# Altium schematic sheet Bluetooth_Module.SchDoc
size A3; SheetNumber: 4; SheetTotal: 7
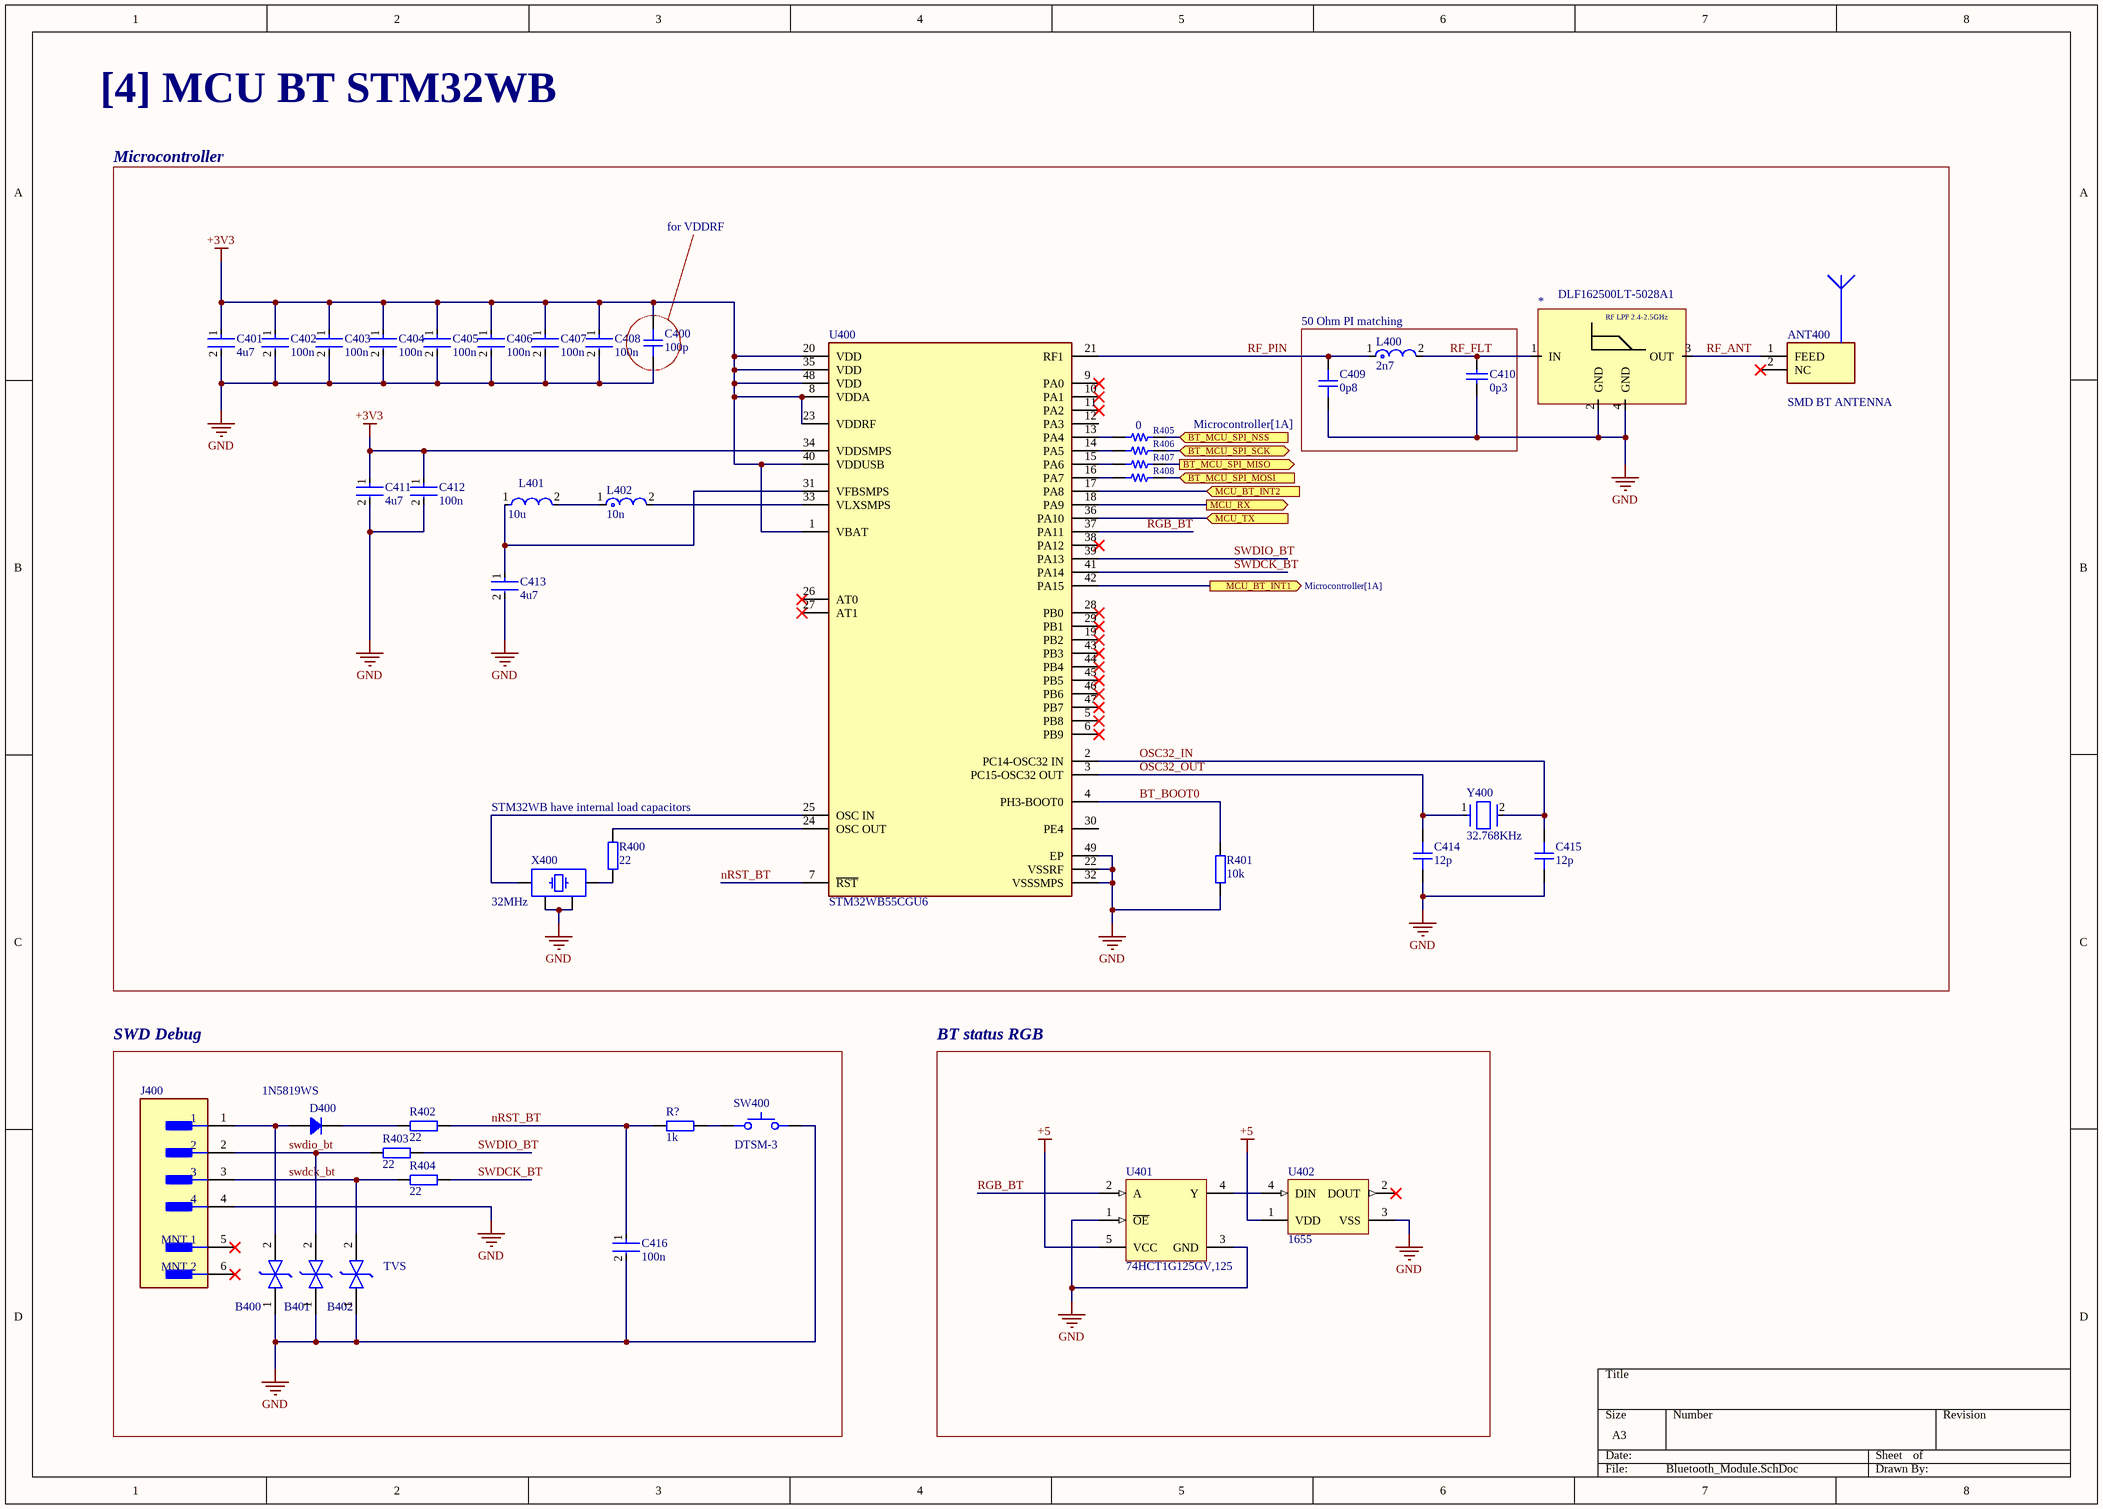
[diagram p0: Bluetooth_Module.SchDoc]

## Parts
*  DLF162500LT-5028A1  [DLF162500LT-5028A1]
ANT400  SMD BT ANTENNA  [ANTC3216X130N]
B400  TVS  [SODFL1608X65N]  (value not drawn)
B401  TVS  [SODFL1608X65N]  (value not drawn)
B402  TVS  [SODFL1608X65N]
C400  100p  [CAP_0402]
C401  4u7  [FP-CL10-IPC_C]
C402  100n  [FP-CL779-IPC_C]
C403  100n  [FP-CL779-IPC_C]
C404  100n  [FP-CL779-IPC_C]
C405  100n  [FP-CL779-IPC_C]
C406  100n  [FP-CL779-IPC_C]
C407  100n  [FP-CL779-IPC_C]
C408  100n  [FP-CL779-IPC_C]
C409  0p8  [CAP_0402]
C410  0p3  [CAPC1005X55X25NL05T10]
C411  4u7  [FP-CL10-IPC_C]
C412  100n  [FP-CL779-IPC_C]
C413  4u7  [FP-CL10-IPC_C]
C414  12p  [CAP_0402]
C415  12p  [CAP_0402]
C416  100n  [FP-CL779-IPC_C]
D400  1N5819WS  [SOD323F]
J400  S4B-XH-SM4-TB(LF)(SN)  [FP-S4B-XH-SM4-TB_LF_SN-MFG]  (value not drawn)
L400  2n7  [FP-LQG15HH_02-IPC_C]
L401  10u  [FP-LQM21FN_70-MFG]
L402  10n  [FP-LQG15WH_02-MFG]
R400  22  [RES_0402]
R401  10k  [RES_0402]
R402  22  [RES_0402]
R403  22  [RES_0402]
R404  22  [RES_0402]
R405  0  [RES 0402_1005]
R406  0  [RES 0402_1005]  (value not drawn)
R407  0  [RES 0402_1005]  (value not drawn)
R408  0  [RES 0402_1005]  (value not drawn)
R?  1k  [RES_0402]
SW400  DTSM-3  [DTSM-3]
U400  STM32WB55CGU6  [FP-STM32WB55CGU6-MFG]
U401  74HCT1G125GV,125  [NXP-SOT753_V]
U402  1655  [ADA-RGB-1655_V]
X400  32MHz  [XTAL_3225]
Y400  32.768KHz  [FP-ABS07AIG-MFG]

## Blocks framed on the sheet
Microcontroller: * ANT400 C400-C408 C411-C415 L401 L402 R400 R401 R405-R408 U400 X400 Y400
50 Ohm PI matching: C409 C410 L400
SWD Debug: B400-B402 C416 D400 J400 R402-R404 R? SW400
BT status RGB: U401 U402

## Ports
BT_MCU_SPI_MISO (out, see Microcontroller[1A]), BT_MCU_SPI_MOSI (in, see Microcontroller[1A]), BT_MCU_SPI_NSS (in, see Microcontroller[1A]), BT_MCU_SPI_SCK (bidir, see Microcontroller[1A]), MCU_BT_INT1 (out, see Microcontroller[1A]), MCU_BT_INT2 (in, see Microcontroller[1A]), MCU_RX (out, see Microcontroller[1A]), MCU_TX (in, see Microcontroller[1A])

## Nets
+3V3: C400.2 C401.1 C402.1 C403.1 C404.1 C405.1 C406.1 C407.1 C408.1 C411.1 C412.1 U400.1(VBAT) U400.8(VDDA) U400.20(VDD) U400.23(VDDRF) U400.34(VDDSMPS) U400.35(VDD) U400.40(VDDUSB) U400.48(VDD)
+5: U401.5(VCC) U402.1(VDD)
GND: *.2(GND) *.4(GND) B400.1(K1) B401.1(K1) B402.1(K1) C400.1 C401.2 C402.2 C403.2 C404.2 C405.2 C406.2 C407.2 C408.2 C409.1 C410.1 C411.2 C412.2 C413.2 C414.1 C415.1 C416.2 J400.4 R401.2 SW400.2 U400.22(VSSRF) U400.32(VSSSMPS) U400.49(EP) U401.1(~{OE}) U401.3(GND) U402.3(VSS) X400.2 X400.4
BT_BOOT0: R401.1 U400.4(PH3-BOOT0)
BT_MCU_SPI_MISO: R407.2 ; port BT_MCU_SPI_MISO
BT_MCU_SPI_MOSI: R408.2 ; port BT_MCU_SPI_MOSI
BT_MCU_SPI_NSS: R405.2 ; port BT_MCU_SPI_NSS
BT_MCU_SPI_SCK: R406.2 ; port BT_MCU_SPI_SCK
MCU_BT_INT1: U400.42(PA15) ; port MCU_BT_INT1
MCU_BT_INT2: U400.17(PA8) ; port MCU_BT_INT2
MCU_RX: U400.18(PA9) ; port MCU_RX
MCU_TX: U400.36(PA10) ; port MCU_TX
nRST_BT: C416.1 R402.1 R?.2 U400.7(~{RST})
OSC32_IN: C415.2 U400.2(PC14-OSC32_IN) Y400.2
OSC32_OUT: C414.2 U400.3(PC15-OSC32_OUT) Y400.1
RF_ANT: *.3(OUT) ANT400.1(FEED)
RF_FLT: *.1(IN) C410.2 L400.2
RF_PIN: C409.2 L400.1 U400.21(RF1)
RGB_BT: U400.37(PA11) U401.2(A)
SWDCK_BT: B402.2(K2) J400.3 R404.1 R404.2 U400.41(PA14)
SWDIO_BT: B401.2(K2) J400.2 R403.1 R403.2 U400.39(PA13)
NetB400_2: B400.2(K2) D400.1 J400.1
NetC413_1: C413.1 L401.1 U400.31(VFBSMPS)
NetD400_2: D400.2 R402.2
NetL401_2: L401.2 L402.1
NetL402_2: L402.2 U400.33(VLXSMPS)
NetR400_1: R400.1 U400.24(OSC_OUT)
NetR400_2: R400.2 X400.3
NetR405_1: R405.1 U400.13(PA4)
NetR406_1: R406.1 U400.14(PA5)
NetR407_1: R407.1 U400.15(PA6)
NetR408_1: R408.1 U400.16(PA7)
NetR?_1: R?.1 SW400.1
NetU400_25: U400.25(OSC_IN) X400.1
NetU401_4: U401.4(Y) U402.4(DIN)

Not connected (* = marked no-connect by the designer): ANT400 2(NC)*; J400 5(MNT_1)* 6(MNT_2)*; U400 5(PB8)* 6(PB9)* 9(PA0)* 10(PA1)* 11(PA2)* 12(PA3) 19(PB2)* 26(AT0)* 27(AT1)* 28(PB0)* 29(PB1)* 30(PE4) 38(PA12)* 43(PB3)* 44(PB4)* 45(PB5)* 46(PB6)* 47(PB7)*; U402 2(DOUT)*

## Notes on the sheet
- [4] MCU BT STM32WB
- for VDDRF
- (near R400) STM32WB have internal load capacitors
- (in symbol DLF162500LT-5028A1) RF LPF 2.4-2.5GHz

## Library data of the parts
ANT400 = RFANT3216120A1T: Antennas 2450+/-50MHz 2.5GHz Fc 2dBi RFANT3216120A1T; Manufacturer_Name: Walsin Technology Corporation; Geometry.Height: 1.3mm; TME Electronic Components Part Number: *; TME Electronic Components Price/Stock: *; Manufacturer_Part_Number: RFANT3216120A1T; Datasheet Link: *
B400-B402 = PESD5V0S1BB_115: PESD5V0S1BB - Bidirectional ESD protection diode Vbr = 5.5V, Vc; Manufacturer_Name: Nexperia; Manufacturer_Part_Number: PESD5V0S1BB,115; Geometry.Height: 0.65mm; Mouser Part Number: 771-PESD5V0S1BB-T/R; Mouser Price/Stock: https://www.mouser.co.uk/ProductDetail/Nexperia/PESD5V0S1BB115?qs=LOCUfHb8d9vW06zz0pOppQ%3D%3D; Arrow Part Number: PESD5V0S1BB,115; Arrow Price/Stock: https://www.arrow.com/en/products/pesd5v0s1bb115/nexperia; Datasheet Link: https://assets.nexperia.com/documents/data-sheet/PESD5V0S1BB.pdf
C400 C409 C414 C415 = CAP_0402: Capacitor SMD 0402; Manufacturer: *; Manufacturer Part Number: *; Distributor Link: *; LCSC: *; Rating: *; Dielectric: *
C401 C411 C413 = CMP-13271-004224-1: Cap Ceramic 10uF 25V X5R ±20% Pad SMD 0603 +85°C T/R; Width: 0.031inch; Voltage Rating: 25V; Length: 0.063inch; Case Code (Metric): 1608; Dielectric: X5R; Termination: Wraparound; Capacitance: 10uF; Lead Free: Lead Free; Mount: Surface Mount; Package Quantity: 1; Case Code (Imperial): 0603; Thickness: 0.035inch; Packaging: Tape and Reel; Contact Plating: Tin; Min Operating Temperature: -55°C; Tolerance: 20%; Max Operating Temperature: 85°C; Case/Package: 0603
C402-C408 C412 C416 = CMP-13271-002336-1: Cap Ceramic 100nF 50V X7R ±10% SMD 0402 +125°C Paper T/R CL05B104KB54PNC
C410 = CMP-1034-00007-2: GRM1555C1HR30WA01D; Manufacturer: Murata; Part Number: GRM1555C1HR30WA01D
D400 = 1N4148WS: 40V 600mV@1A 1A SOD-323 1N5819WS; Manufacturer: ON Semiconductor; Current - Average Rectified (Io): 150mA; Current - Reverse Leakage @ Vr: 5µA @ 75V; Diode Type: Standard; Reverse Recovery Time (trr): 4ns; Speed: Small Signal =< 200mA (Io), Any Speed; Voltage - DC Reverse (Vr) (Max): 75V; Voltage - Forward (Vf) (Max) @ If: 1V @ 10mA; Part Number: 1N4148WS; ComponentLink1Description: Datasheet; ComponentLink1URL: https://www.onsemi.com/pub/Collateral/1N914BWS-D.pdf; ComponentLink2Description: DigiKey Link; ComponentLink2URL: http://digikey.com/product-detail/en/on-semiconductor/1N4148WS/1N4148WSFSCT-ND/1873821; LastUpdated: 29.01.2024 21:26:23; Lifecycle Status: Active; Minimum Order: 1; Mounting Type: Surface Mount; Operating Temperature - Junction: 150°C (Max); Package / Case: SC-90, SOD-323F; Packaging: TapeAndReel; PartId: 1158; Part Status: Active; Price: 0.03; Series: -; Supplier 1: DigiKey; Supplier Part Number 1: 1N4148WSFSCT-ND; Supplier Device Package: SOD-323F
J400 = CMP-17439-000072-1: CONN HEADER SMD R/A 4POS 2.5MM; Number of Positions: 4; Max Current Rating: 3A; Max Voltage Rating (AC): 250V; Connector Type: Male Pin; Contact Resistance: 20mR; Gender: Male; Pitch: 0.098inch; Max Operating Temperature: 85°C; Contact Plating: Tin; Housing Material: Polyamide; Housing Color: Beige; Depth: 10mm; Series: XH; Package Quantity: 1; Length: 15mm; Contact Material: Copper Alloy; Min Operating Temperature: -25°C; REACH SVHC: No SVHC; Orientation: Right Angle; Number of Rows: 1; Contact Type: Male Pin; Color: Natural; Lead Free: Lead Free; Termination: Solder; Mount: Surface Mount; Number of Contacts: 4; Packaging: Tape and Reel
L400 = CMP-2000-06580-2: Multilayer type RF Inductor 2.7nH ±0.3nH 0.12Ω 800mA 0402 LQG15HS2N7S02D; Max DC Current: 300mA; Q Factor: 8; Core Material: Air; Test Frequency: 100MHz; Shielding: Unshielded; Self Resonant Frequency: 6GHz; DC Resistance (DCR): 150mR; Packaging: Tape and Reel; Depth: 0.55mm; DC Current: 300mA; Length: 1mm; Current Rating: 300mA; Lead Free: Lead Free; Max Operating Temperature: 125°C; Mount: Surface Mount; Height - Seated (Max): 0.022inch; Case Code (Imperial): 0402; Height: 0.5mm; Termination: SMD/SMT; Package Quantity: 10000; Radiation Hardening: No; Width: 0.5mm; Case Code (Metric): 1005; Min Operating Temperature: -55°C; Military Standard: Not; Case/Package: 0402; Inductance: 2.7nH
L401 = CMP-2000-06587-2: FIXED IND 10UH 100MA 780MOHM SMD LQM21FN100M70L; Shielding: Shielded; Core Material: Ferrite; Self Resonant Frequency: 15MHz; Tolerance: 20%; DC Resistance (DCR): 780mR; Test Frequency: 1MHz; Height: 1.45mm; Package Quantity: 3000; Width: 0.049inch; Inductance: 10uH; Saturation Current: 100mA; Termination: SMD/SMT; Case Code (Metric): 2012; Case/Package: 0805; RoHS Compliant: Yes; Series: LQM21F_70; Max Operating Temperature: 125°C; Lead Free: Lead Free; DC Current: 100mA; Length: 2.2mm; Radiation Hardening: No; Max DC Current: 100mA; Case Code (Imperial): 0805; Packaging: Tape and Reel; Height - Seated (Max): 0.057inch; Rated Current-Max: 100mA; Military Standard: Not; Mount: Surface Mount; Min Operating Temperature: -55°C; Depth: 1.45mm; Current Rating: 100mA
L402 = CMP-06042-005237-1: Multilayer type Inductor for Automotive 10nH ±5% 0.19Ω 500mA 0402 LQG15WZ10NJ02D; Core Material: Air; Test Frequency: 100MHz; DC Resistance (DCR): 190mR; Shielding: Unshielded; Self Resonant Frequency: 3.3GHz; Min Operating Temperature: -55°C; Tolerance: 5%; Inductance: 10nH; Max Operating Temperature: 125°C; Packaging: Cut Tape; Current Rating: 500mA; Case Code (Metric): 1005; Mount: Surface Mount; Case/Package: 0402; Ratings: AEC-Q200; Case Code (Imperial): 0402
R400-R404 R? = RES_0402: Resistor SMD 0402; Manufacturer: *; Manufacturer Part Number: *; Distributor Link: *; LCSC: *
R405-R408 = RP73PF1E249KBTD: RES 249K OHM 0.1% 1/10W 0402; Manufacturer: TE Connectivity Passive Product; Power (Watts): 0.1W, 1/10W; Resistance: 249 kOhms; Temperature Coefficient: ±25ppm/°C; Part Number: RP73PF1E249KBTD; Value: 0; ComponentLink1Description: Datasheet; ComponentLink1URL: https://www.te.com/commerce/DocumentDelivery/DDEController?Action=srchrtrv&DocNm=1773272&DocType=DS&DocLang=English; ComponentLink2Description: DigiKey Link; ComponentLink2URL: https://www.digikey.com/en/products/detail/te-connectivity-passive-product/RP73PF1E249KBTD/8261091; Composition: Thin Film; Device Package: 0402 (1005 Metric); Height - Seated (Max): 0.014" (0.35mm); LastUpdated: 09.02.2024 20:30:24; Lifecycle Status: Active; Minimum Order: 1; Number of Terminations: 2; Operating Temperature: -55°C ~ 155°C; Package / Case: 0402 (1005 Metric); Packaging: TapeAndReel; PartId: 2418; Part Status: Active; Price: 0.07; Series: RP73, Holsworthy; Size / Dimension: 0.039" L x 0.020" W (1.00mm x 0.50mm); Supplier 1: DigiKey; Supplier Part Number 1: A127549CT-ND; Supplier Device Package: 0402; Tolerance: ±0.1%
SW400 = DTSM-3: Tactile Switch SMD SPST; Manufacturer: Diptronics; Manufacturer Part Number: DTSM-3
U400 = CMP-12105-000013-1: ULTRA-LOW-POWER DUAL CORE ARM CO; Manufacturer: STMicroelectronics; Number Of Cores: 1; Number Of I2C Channels: 2; Interface: I2C,SPI,UART,USART,2-Wire,USB,IrDA,Other; Core Architecture: ARM Cortex-M4; Data Bus Width: 32bits; Memory Size: 1MBytes; Number Of Pwm Channels: 14; Max Supply Voltage: 3.6V; Standoff Height: 0mm; Number Of Timers/Counters: 6; Frequency: 64MHz; Max Junction Temp: +105°C; Number Of I/Os: 30; Min Supply Voltage: 1.71V; Number Of Adc Channels: 13; Ram Size: 256KBytes; Memory Type: FLASH; Octopart: https://octopart.com/stm32wb55cgu6-stmicroelectronics-98750847; Temperature Range High: +105°C; RoHS: TRUE; Number Of Spi Channels: 1; Category: IC; Device Class L1: Integrated Circuits (ICs); Lead Free: Yes; Height: 0.65mm; Number Of A/D Converters: 1; Package: UFQFPN48; Number Of Usb Channels: 1; Number Of Uart Channels: 2; Temperature Range Low: -40°C; Ambient Temperature Range Low: -40°C; Device Class L3: Microcontrollers; Manufacturer Part Number: STM32WB55CGU6; Temperature: -40°C to +105°C; ComponentLink2URL: https://www.st.com/resource/en/datasheet/stm32wb55cg.pdf; Device Class L2: Embedded Processors and Controllers; Digikey Description: ULTRA-LOW-POWER DUAL CORE ARM CO; ComponentLink2Description: Datasheet; Ambient Temperature Range High: +85°C; Automotive: No
U401 = CMP-1328-00004-1: High-Speed, Si-Gate CMOS Device, 4.5 to 5.5 V, -40 to 125 degC, 5-Pin SC-74A (SOT753), RoHS, Reel; Manufacturer: NXP Semiconductors; Ci: 1.5 pF Typ.; CPD: 27 pF Typ.; VO: 0 to 5.5 V; PartNumber: 74HCT1G125GV,125; ComponentLink3Description: Package Specification; ComponentLink1URL: http://www.nxp.com/; Temperature Range: -40 to 125 degC; ComponentLink3URL: http://www.nxp.com/documents/outline_drawing/sot753_po.pdf; RoHS: TRUE; Mounting Technology: Surface Mount; PackageVersion: Mar-06; Packing: Reel; ComponentLink2Description: Datasheet; ComponentLink2URL: http://www.nxp.com/documents/data_sheet/74HC_HCT1G125.pdf; PackageDescription: 5-Pin Plastic Surface Mounted Package, Body 2.9 x 1.5 mm, Pitch 0.95 mm; DatasheetVersion: Rev. 05; VCC: 4.5 to 5.5 V; ComponentLink1Description: Manufacturer URL; VI: 0 to 5.5 V
U402 = CMP-2000-05026-1: Intelligent Control LED Integrated Light Source, 3.5 to 5.3 V, -25 to 80 degC, 4-Pin SMD, RoHS, Tape and Reel; Manufacturer: Adafruit-Industries-LLC; Number of LEDs: 10; Configuration: Discrete; Utilized LED: WS2812(5050); Datasheet URL: http://datasheet.octopart.com/ADA1655-Adafruit-Industries-datasheet-32028139.pdf; Series: Neopixel; Interface: -; Package Description: 4-Pin Surface Mount Device, Body 5 x 5 mm; Color: Red,Green,Blue(RGB); Category: Optoelectronics; Controller Type: -; Package Reference: 1655; Manufacturer URL: https://www.adafruit.com/; Mounting Type: SurfaceMount; Datasheet Version: May-13; Size / Dimension: 5.00mmLx5.00mmW; Family: Addressable,Specialty
X400 = TSX-3225_24.0000MF15X-AC: Crystal SMD 24MHz 10PPM 7pF 3225; Manufacturer: Epson; Manufacturer Part Number: TSX-3225 24.0000MF15X-AC
Y400 = CMP-27762-011927-2: CRYSTAL 32.7680KHZ 12.5PF SMD Q13FC1350000400; Frequency Tolerance: 10ppm; ESR (Equivalent Series Resistance): 80kR; Series: ABS07AIG; Packaging: Cut Tape; Ratings: AEC-Q200; Case/Package: SMD/SMT; Max Operating Temperature: 125°C; Min Operating Temperature: -40°C; Width: 0.059inch; Frequency: 32.768kHz; Mount: Surface Mount; Height: 0.035inch; RoHS Compliant: Yes; Length: 0.126inch; Load Capacitance: 12.5pF; Number of Pins: 2